# Altium schematic sheet Block_diagram.SchDoc
size A; SheetNumber: 1; SheetTotal: 2
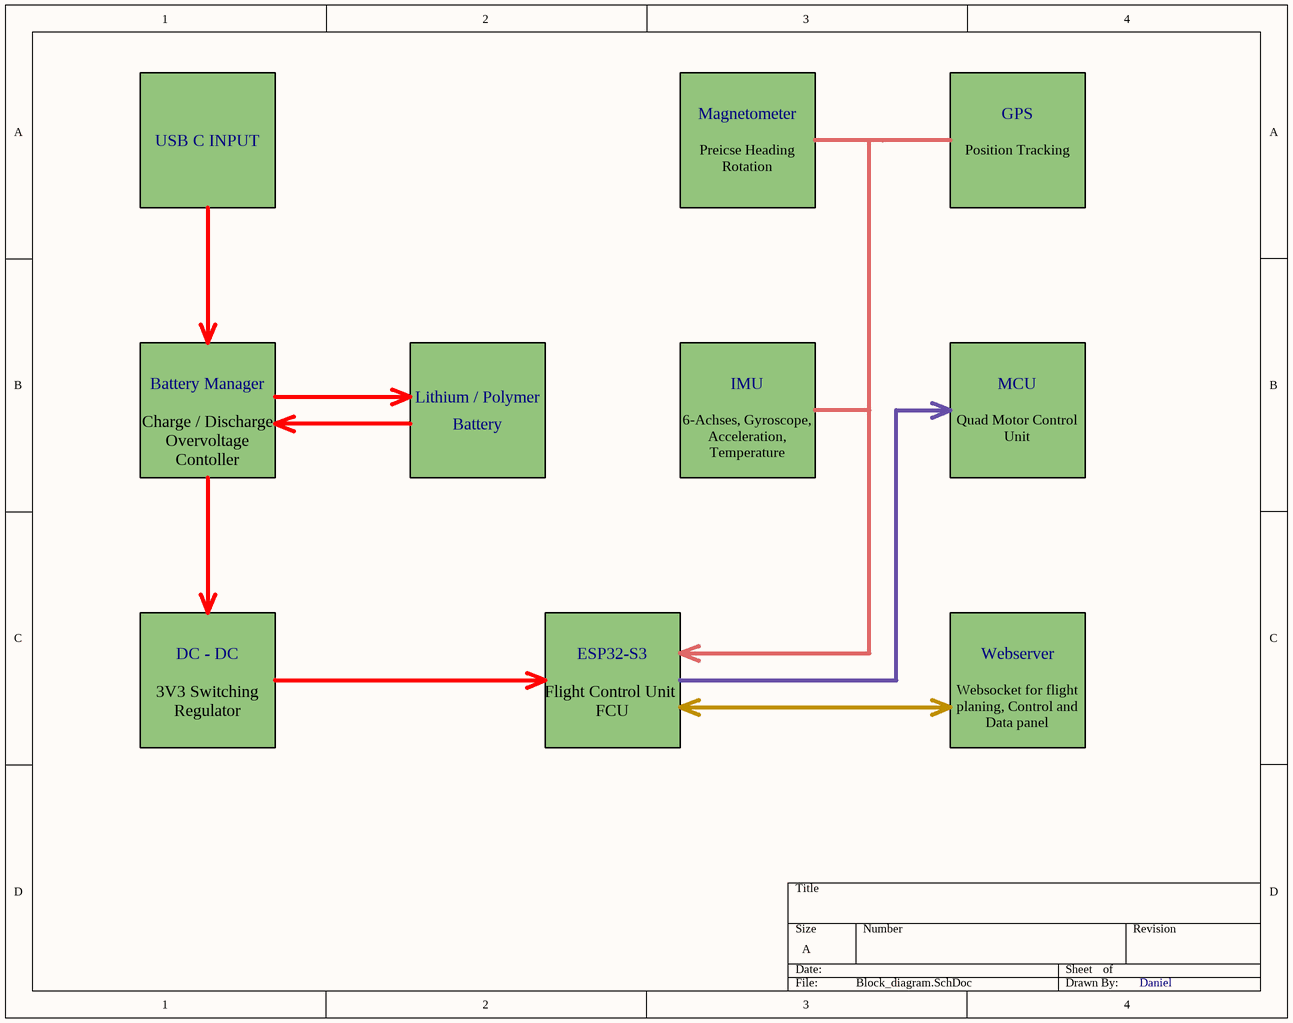
[diagram p0: Block_diagram.SchDoc]

## Notes on the sheet
- USB C INPUT
- Magnetometer
- GPS
- Preicse Heading
  Rotation
- Position Tracking
- Battery Manager
- Lithium / Polymer
- Battery
- IMU
- MCU
- Charge / Discharge
  Overvoltage
  Contoller
- 6-Achses, Gyroscope, Acceleration, Temperature
- Quad Motor Control Unit
- DC - DC
- ESP32-S3
- Webserver
- 3V3 Switching Regulator
- Flight Control Unit
  FCU
- Websocket for flight planing, Control and Data panel
- Daniel